# Altium schematic sheet sensor.SchDoc
size A4
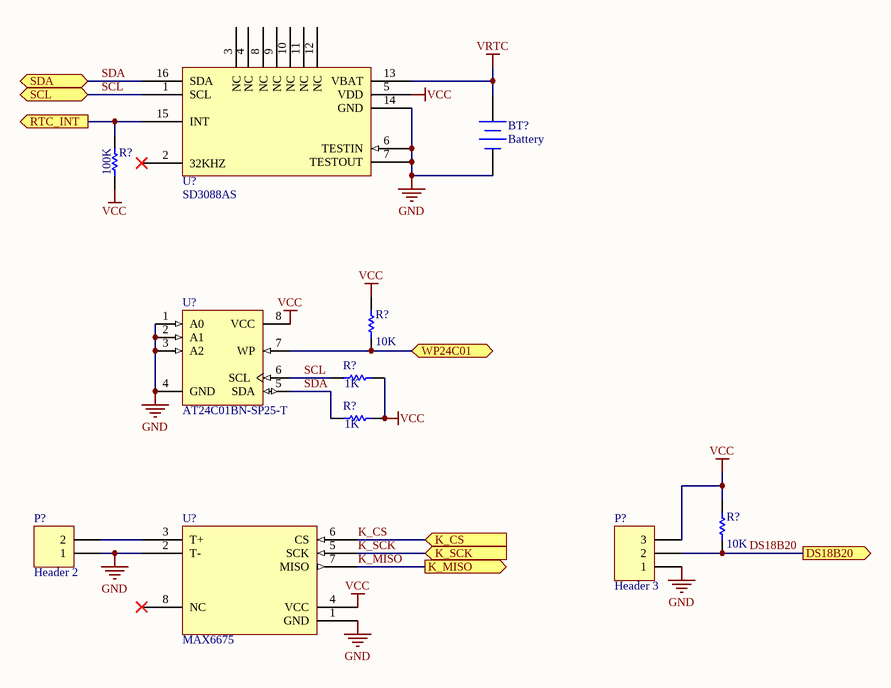
[diagram p0: sensor.SchDoc]

## Parts
(Parts that share a designator on the sheet are numbered #1, #2 ... from top to bottom, then left to right.)
BT?  Battery  [BAT-2]
P?#1  Header 2  [HDR1X2]
P?#2  Header 3  [HDR1X3]
R?#1  value 100K  [AXIAL-0.3]  (hidden comment: Res1)
R?#2  value 10K  [AXIAL-0.3]  (hidden comment: Res1)
R?#3  value 1K  [AXIAL-0.3]  (hidden comment: Res1)
R?#4  value 1K  [AXIAL-0.3]  (hidden comment: Res1)
R?#5  value 10K  [AXIAL-0.3]  (hidden comment: Res1)
U?#1  SD3088AS
U?#2  AT24C01BN-SP25-T  [8S1_N]
U?#3  MAX6675

## Ports
DS18B20 (out), K_CS (in), K_MISO (out), K_SCK (in), RTC_INT (out), SCL (bidir), SDA (bidir), WP24C01

## Nets
GND: BT?.2(-) P?#1.1 P?#2.1 U?#1.6(TESTIN) U?#1.7(TESTOUT) U?#1.14(GND) U?#2.1(A0) U?#2.2(A1) U?#2.3(A2) U?#2.4(GND) U?#3.1(GND) U?#3.2(T-)
VCC: P?#2.3 R?#1.1 R?#2.2 R?#3.2 R?#4.2 R?#5.2 U?#1.5(VDD) U?#2.8(VCC) U?#3.4(VCC)
VRTC: BT?.1(+) U?#1.13(VBAT)
DS18B20: P?#2.2 R?#5.1 ; port DS18B20
K_CS: U?#3.6(CS) ; port K_CS
K_MISO: U?#3.7(MISO) ; port K_MISO
K_SCK: U?#3.5(SCK) ; port K_SCK
RTC_INT: R?#1.2 U?#1.15(INT) ; port RTC_INT
SCL: R?#3.1 U?#1.1(SCL) U?#2.6(SCL) ; port SCL
SDA: R?#4.1 U?#1.16(SDA) U?#2.5(SDA) ; port SDA
WP24C01: R?#2.1 U?#2.7(WP) ; port WP24C01
NetP?#1_2: P?#1.2 U?#3.3(T+)

Not connected (* = marked no-connect by the designer): U?#1 2(32KHZ)* 3(NC) 4(NC) 8(NC) 9(NC) 10(NC) 11(NC) 12(NC); U?#3 8(NC)*

## Library data of the parts
BT? = Battery: Multicell Battery; Published: 24-Mar-1999; LatestRevisionDate: 17-Jul-2002; LatestRevisionNote: Re-released for DXP Platform.; PackageReference: BAT-2; Publisher: Altium Limited; PackageDescription: Battery; 2 Leads
P?#1 = Header 2: Header, 2-Pin; LatestRevisionDate: 17-Jul-2002; LatestRevisionNote: Re-released for DXP Platform.; Publisher: Altium Limited
P?#2 = Header 3: Header, 3-Pin; LatestRevisionDate: 17-Jul-2002; LatestRevisionNote: Re-released for DXP Platform.; Publisher: Altium Limited
R?#1-R?#5 = Res1: Resistor; Published: 8-Jun-2000; LatestRevisionDate: 17-Jul-2002; LatestRevisionNote: Re-released for DXP Platform.; PackageReference: AXIAL-0.3; Publisher: Altium Limited; PackageDescription: Axial Device, Thru-Hole; 2 Leads; 0.3 in Pin Spacing
U?#2 = AT24C01BN-SP25-T: 1Kbit (128 x 8), 2-wire Bus Automotive Serial EEPROM with Write Protect, 2.5V, 8-Pin SOIC, Tape & Reel; Published: 20-Sep-2010; DatasheetVersion: 8517C,  Jan-2009; PackageVersion: revC, Mar-2005; PackageReference: 8S1; Publisher: Altium Limited; PackageDescription: 8-Lead (0.150" Wide Body), Plastic Gull Wing Small Outline (JEDEC SOIC); Code_JEDEC: MS-012-AA; Code_IPC: SOIC127P600-8; ComponentLink1Description: Manufacturer Link; ComponentLink1URL: http://www.atmel.com/products/serial/default.asp; ComponentLink2Description: Datasheet; ComponentLink2URL: http://www.atmel.com/dyn/resources/prod_documents/doc8517.pdf; ComponentLink3Description: Atmel.com Home; ComponentLink3URL: http://www.atmel.com